# EAGLE schematic pb_debug (EAGLE 6.3)

## Sheet 1 of 3: 12-pin 1.27mm Connector
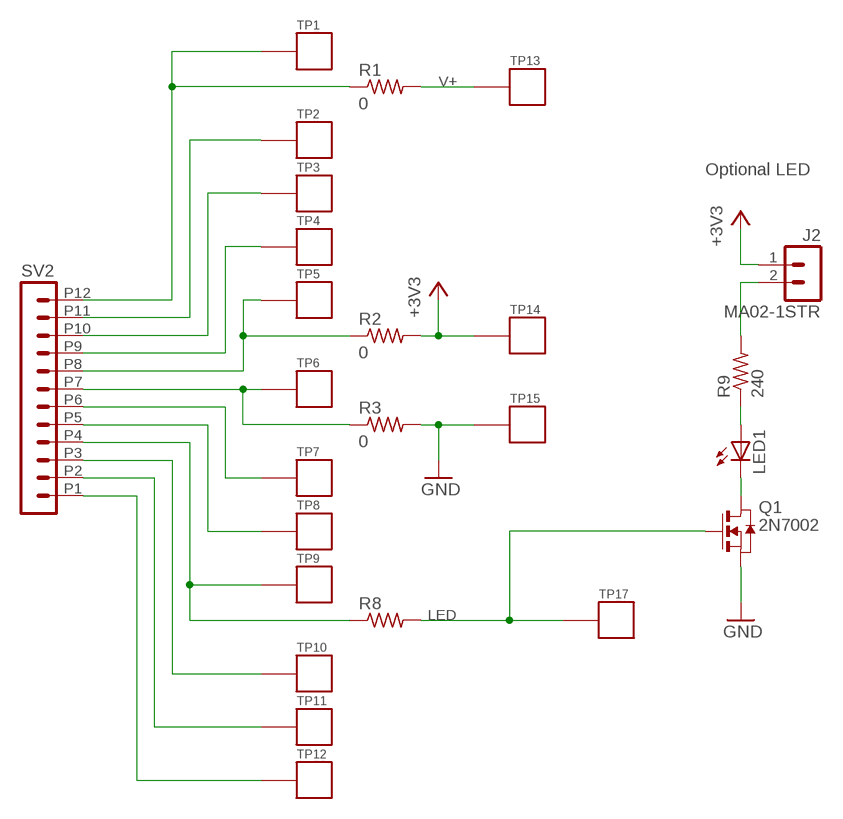
[diagram p0: schematic, sheet 1]

### Parts
J2  MA02-1STR  [MA02-1]
LED1  LED0603  [LED-0603]
Q1  2N7002  [SC-70-3]
R1  0  R-US_R0603  [R0603]
R2  0  R-US_R0603  [R0603]
R3  0  R-US_R0603  [R0603]
R8  R-US_R0603  [R0603]
R9  240  R-US_R0603  [R0603]
SV2  MA12-11MM27_LONG  [MA12-1_1MM27_LONG]
TP1  TP_MULT  [TP_MULT]
TP2  TP_MULT  [TP_MULT]
TP3  TP_MULT  [TP_MULT]
TP4  TP_MULT  [TP_MULT]
TP5  TP_MULT  [TP_MULT]
TP6  TP_MULT  [TP_MULT]
TP7  TP_MULT  [TP_MULT]
TP8  TP_MULT  [TP_MULT]
TP9  TP_MULT  [TP_MULT]
TP10  TP_MULT  [TP_MULT]
TP11  TP_MULT  [TP_MULT]
TP12  TP_MULT  [TP_MULT]
TP13  TP_STD  [TP]
TP14  TP_STD  [TP]
TP15  TP_STD  [TP]
TP17  TP_STD  [TP]

### Nets
+3V3: J2.1 R2.2 TP14.P$1 ; also sheet 2,3
GND: Q1.P2(S) R3.2 TP15.P$1 ; also sheet 2,3
LED: Q1.P1(G) R8.2 TP17.P$1
N$1: R1.1 SV2.P12 TP1.P$1
N$2: SV2.P11 TP2.P$1
N$3: SV2.P10 TP3.P$1
N$4: SV2.P9 TP4.P$1
N$5: R2.1 SV2.P8 TP5.P$1
N$6: R3.1 SV2.P7 TP6.P$1
N$8: SV2.P6 TP7.P$1
N$9: SV2.P5 TP8.P$1
N$10: R8.1 SV2.P4 TP9.P$1
N$11: SV2.P3 TP10.P$1
N$12: SV2.P2 TP11.P$1
N$13: SV2.P1 TP12.P$1
N$22: LED1.C Q1.P3(D)
N$23: LED1.A R9.1
N$24: J2.2 R9.2
V+: R1.2 TP13.P$1 ; also sheet 2

### Notes on the sheet
- Optional LED

## Sheet 2 of 3: V+ Amplifier
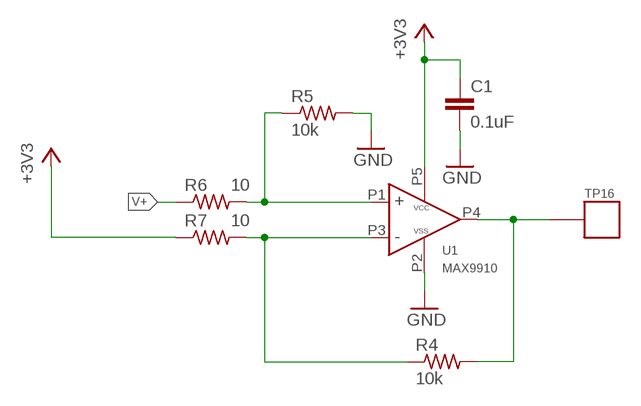
[diagram p1: schematic, sheet 2]

### Parts
C1  0.1uF  C-EUC0603  [C0603]
R4  10k  R-US_R0603  [R0603]
R5  10k  R-US_R0603  [R0603]
R6  10  R-US_R0603  [R0603]
R7  10  R-US_R0603  [R0603]
TP16  TP_MULT  [TP_MULT]
U1  MAX9910  [SC70-5]

### Nets
+3V3: C1.1 R7.1 U1.P5(VCC) ; also sheet 1,3
GND: C1.2 R5.2 U1.P2(VSS) ; also sheet 1,3
N$19: R5.1 R6.2 U1.P1(IN+)
N$20: R4.1 R7.2 U1.P3(IN-)
N$21: R4.2 TP16.P$1 U1.P4(OUT)
V+: R6.1 ; also sheet 1

## Sheet 3 of 3: Programmer (future proofing)
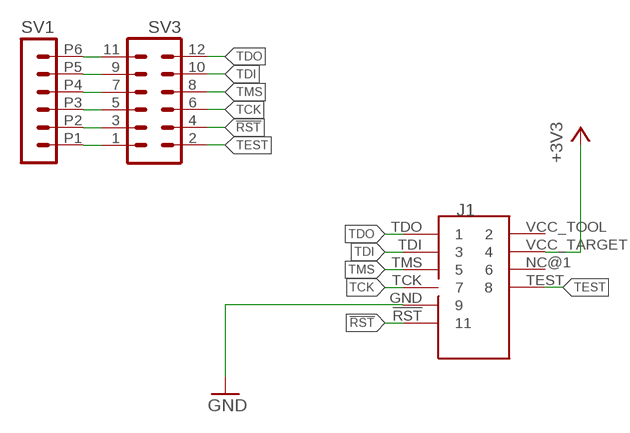
[diagram p2: schematic, sheet 3]

### Parts
J1  JTAG_14PIN_FULL  [MA14-JTAG]
SV1  MA06-11MM27_LONG  [MA06-1_1MM27_LONG]
SV3  MA06-2  [MA06-2]

### Nets
!RST!: J1.!RST! SV3.4
+3V3: J1.VCC_TARGET ; also sheet 1,2
GND: J1.GND ; also sheet 1,2
N$7: SV1.P6 SV3.11
N$14: SV1.P5 SV3.9
N$15: SV1.P4 SV3.7
N$16: SV1.P3 SV3.5
N$17: SV1.P2 SV3.3
N$18: SV1.P1 SV3.1
TCK: J1.TCK SV3.6
TDI: J1.TDI SV3.10
TDO: J1.TDO SV3.12
TEST: J1.TEST SV3.2
TMS: J1.TMS SV3.8
Unconnected: J1.NC@1 J1.VCC_TOOL

## Library data of the parts
C1 = rcl:C-EU: CAPACITOR, European symbol
J1 = ibat:JTAG_14PIN; DIGIKEY: HRP14H-ND
J2 = con-lstb:MA02-1
LED1 = SparkFun-LED:LED: LEDs Standard schematic elements and footprints for 5mm, 3mm, 1206, and 0603 sized LEDs. 5mm - Spark Fun Electronics SKU : COM-00529 (and others)
Q1 = nav:2N7002; DIGIKEY: 2N7002WCT-ND
R1-R9 = rcl:R-US_: RESISTOR, American symbol
SV1 = con-lstb:MA06-1: PIN HEADER
SV2 = con-lstb:MA12-1: PIN HEADER
SV3 = con-lstb:MA06-2: PIN HEADER; OC_FARNELL: unknown; OC_NEWARK: unknown
TP1-TP17 = skyspecs:TP
U1 = powerfilm:MAX9910; DIGIKEY: MAX9910EXK+TCT-ND